# EAGLE design PiMonitorRF (EAGLE 7.5.0)
CNAME: PiCrusts; CREVISION: 1.0; DESIGNER: Prajwal Bhattaram
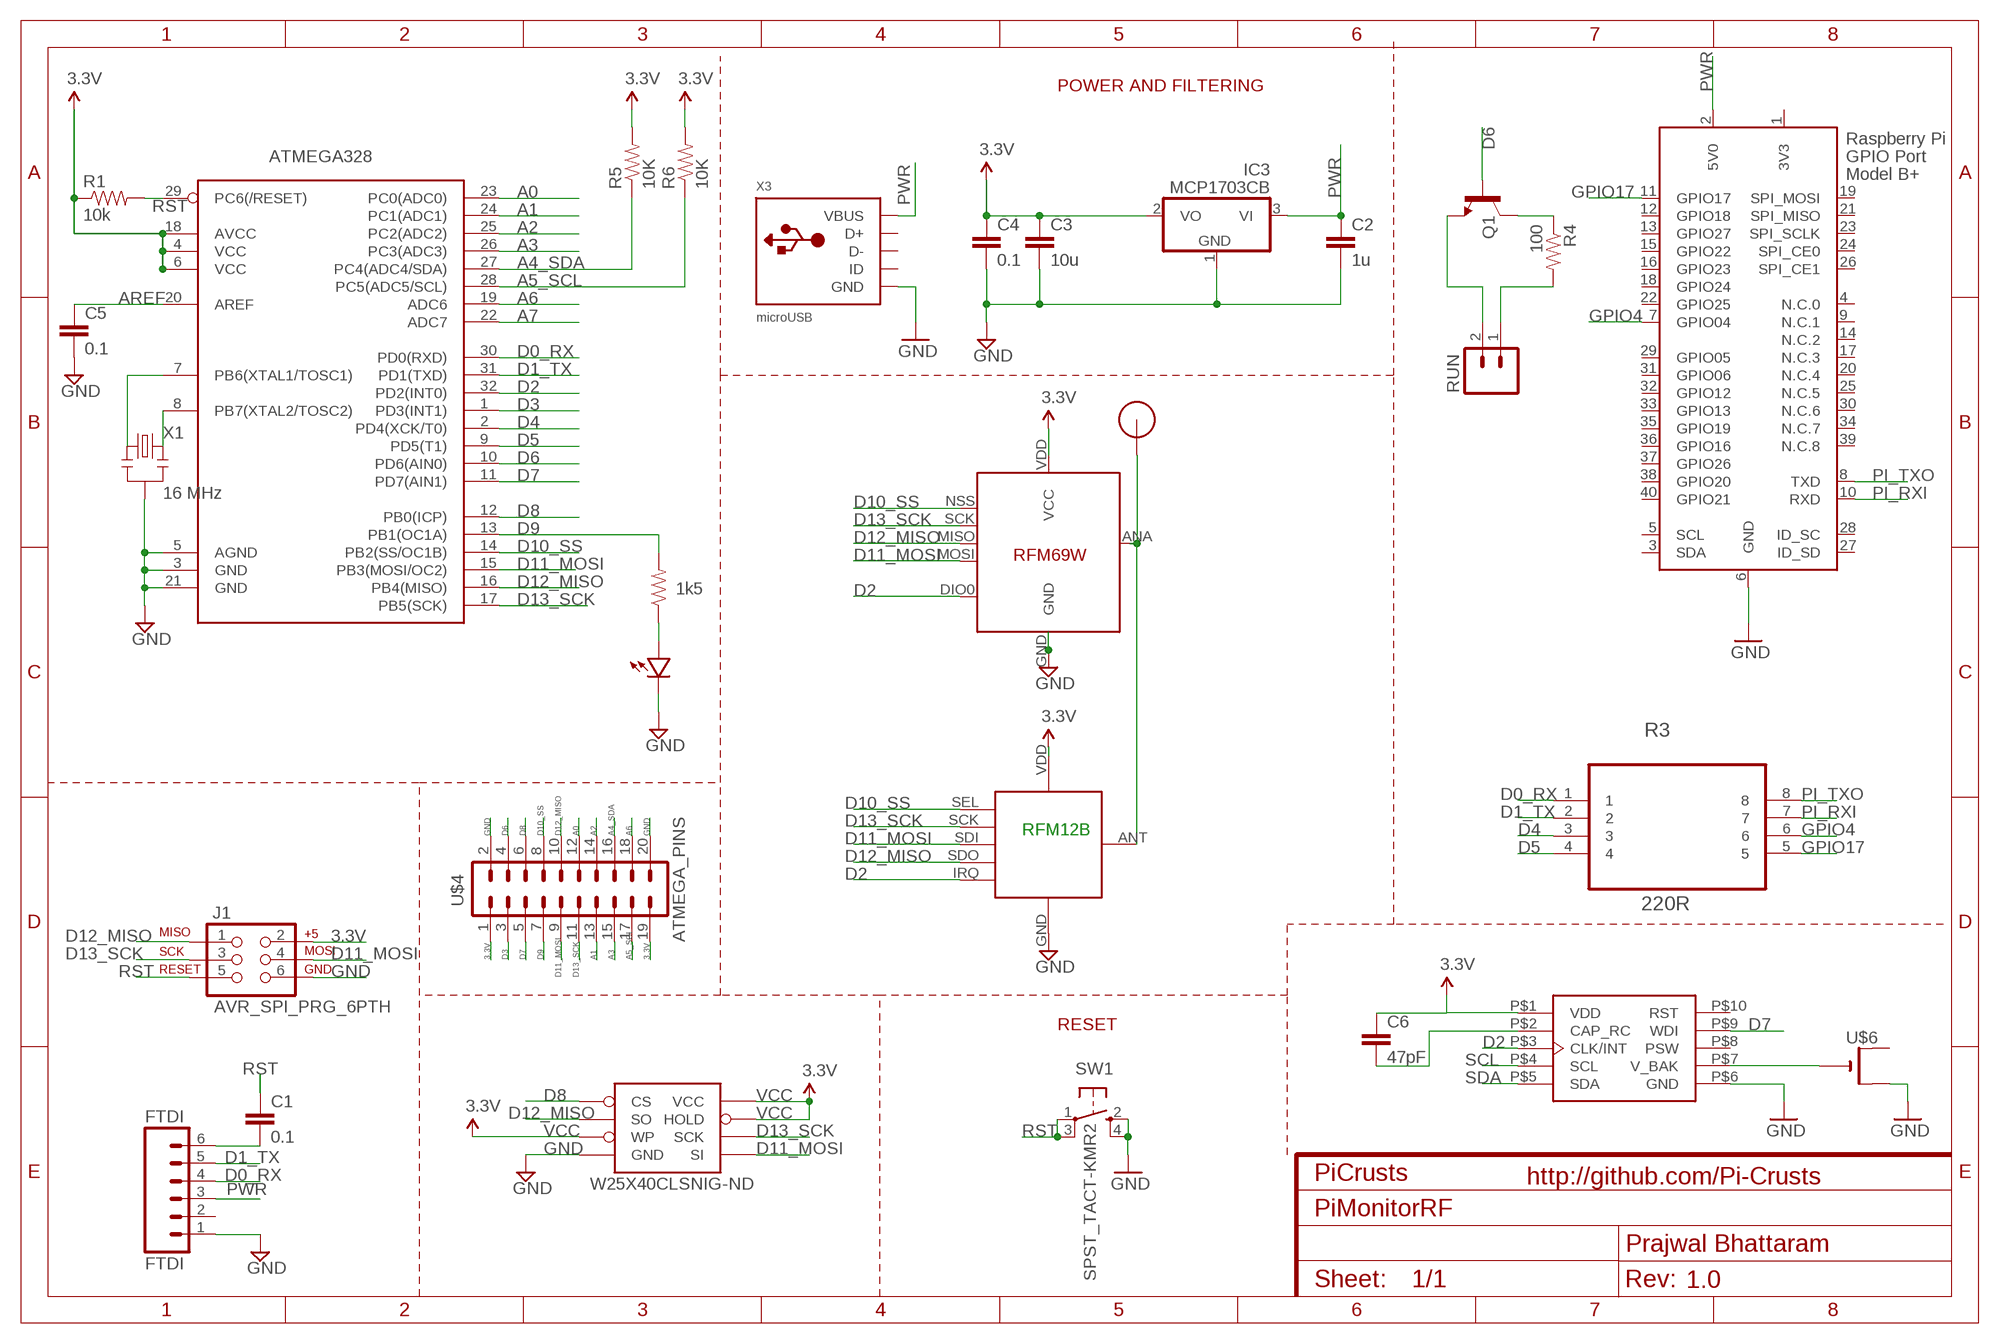
[diagram p0: schematic, sheet 1]

## Parts
ATMEGA328  ATMega-328  ATMEGA168/328TQFP32  [TQFP32-08]
C1  0.1  CAP0603-CAP  [0603-CAP]
C2  1u  CAP0603-CAP  [0603-CAP]
C3  10u  CAP0805-CAP  [0805-CAP]
C4  0.1  CAP0603-CAP  [0603-CAP]
C5  0.1  CAP0603-CAP  [0603-CAP]
C6  47pF  CAP0402-CAP  [0402-CAP]
FTDI  FTDI  M06SIP  [1X06]
IC3  MCP1703CB  [SOT23]
J1  AVR_SPI_PRG_6PTH  [2X3]
Q1  MMBT2222A  TRANSISTOR_NPNMMBT2222A  [SOT23-3]
R1  10k  RESISTOR0603-RES  [0603-RES]
R2  1k5  RESISTOR0603-RES  [0603-RES]
R3  220R  EXB38V221JV  [RESCAXE80P320X160X60-8N]
R4  100  RESISTOR0402-RES  [0402-RES]
R5  10K  RESISTOR0603  [0603-RES]
R6  10K  RESISTOR0603  [0603-RES]
RFM12B  RFM12B_MINPADS  [RFM12B-MINPADS]
RUN  M021X02_NO_SILK  [1X02_NO_SILK]
SW1  SPST_TACT-KMR2  [KMR2]
U$1  RFM12B_ANTENNA  [RFM12B-ANTENNA]
U$2  LED0603  [0603-LED]
U$4  ATMEGA_PINS  M10X2NOSILK  [2X10_NOSILK]
U$5  RFM69  [RFM69W-MINPADS]
U$6  CR1220SMT  [CR1220-SMD]
W25X40CLSNIG-ND  AT25F512BWIDE_5.3MM  [SO08WIDE]
X1  16 MHz  RESONATORSMD  [RESONATOR-SMD]
X2  MC-RTC-RV-1805-C3-I2C  [MC-RTC-C3]
X3  microUSB  USB_MICRO_20329_V2  [4UCONN_20329_V2]
X4  RASPI_BOARD_B+_HDC  [RASPI_BOARD_B+HAT_DF_CF]

## Nets
3.3V: J1.2 U$4.1 U$4.19
A0: ATMEGA328.23(PC0(ADC0)) U$4.12
A1: ATMEGA328.24(PC1(ADC1)) U$4.13
A2: ATMEGA328.25(PC2(ADC2)) U$4.14
A3: ATMEGA328.26(PC3(ADC3)) U$4.15
A4_SDA: ATMEGA328.27(PC4(ADC4/SDA)) R5.1 U$4.16
A5_SCL: ATMEGA328.28(PC5(ADC5/SCL)) R6.1 U$4.17
A6: ATMEGA328.19(ADC6) U$4.18
A7: ATMEGA328.22(ADC7)
AREF: ATMEGA328.20(AREF) C5.1
D0_RX: ATMEGA328.30(PD0(RXD)) FTDI.4 R3.1
D1_TX: ATMEGA328.31(PD1(TXD)) FTDI.5 R3.2
D2: ATMEGA328.32(PD2(INT0)) RFM12B.IRQ U$5.DIO0 X2.P$3(CLK/INT)
D3: ATMEGA328.1(PD3(INT1)) U$4.3
D4: ATMEGA328.2(PD4(XCK/T0)) R3.3
D5: ATMEGA328.9(PD5(T1)) R3.4
D6: ATMEGA328.10(PD6(AIN0)) Q1.1(B) U$4.4
D7: ATMEGA328.11(PD7(AIN1)) U$4.5 X2.P$9(WDI)
D8: ATMEGA328.12(PB0(ICP)) U$4.6 W25X40CLSNIG-ND.1(CS)
D9: ATMEGA328.13(PB1(OC1A)) R2.2 U$4.7
D10_SS: ATMEGA328.14(PB2(SS/OC1B)) RFM12B.SEL U$4.8 U$5.NSS(SEL)
D11_MOSI: ATMEGA328.15(PB3(MOSI/OC2)) J1.4 RFM12B.SDI(SDI/MOSI) U$4.9 U$5.MOSI W25X40CLSNIG-ND.5(SI)
D12_MISO: ATMEGA328.16(PB4(MISO)) J1.1 RFM12B.SDO(SDO/MISO) U$4.10 U$5.MISO W25X40CLSNIG-ND.2(SO)
D13_SCK: ATMEGA328.17(PB5(SCK)) J1.3 RFM12B.SCK U$4.11 U$5.SCK W25X40CLSNIG-ND.6(SCK)
GND [power]: ATMEGA328.3(GND) ATMEGA328.5(AGND) ATMEGA328.21(GND) C2.2 C3.2 C4.2 C5.2 FTDI.1 IC3.1(GND) J1.6 RFM12B.GND SW1.2(S) SW1.4(S1) U$2.MINUS U$4.2 U$4.20 U$5.GND U$6.+$2(+1) W25X40CLSNIG-ND.4(GND) X1.2 X2.P$6(GND) X3.BASE@1(GND) X3.BASE@2(GND) X3.GND X3.SPRT@1(GND) X3.SPRT@2(GND) X3.SPRT@3(GND) X3.SPRT@4(GND) X4.6(GND)
GPIO4: R3.6 X4.7(GPIO04)
GPIO17: R3.5 X4.11(GPIO17)
N$1: ATMEGA328.7(PB6(XTAL1/TOSC1)) X1.1
N$2: R2.1 U$2.PLUS
N$3: RFM12B.ANT U$1.P$1 U$5.ANA(ANT)
N$4: R4.2 RUN.1
N$5: Q1.2(E) RUN.2
N$6: U$6.- X2.P$7(V_BAK)
N$7: Q1.3(C) R4.1
N$8: C6.2 X2.P$2(CAP_RC)
N$20: C1.2 FTDI.6
N$21: ATMEGA328.8(PB7(XTAL2/TOSC2)) X1.3
PI_RXI: R3.7 X4.10(RXD)
PI_TXO: R3.8 X4.8(TXD)
PWR [power]: C2.1 FTDI.3 IC3.3(VI) X3.VBUS X4.2(5V0)
RST: ATMEGA328.29(PC6(/RESET)) C1.1 J1.5 R1.2 SW1.1(P) SW1.3(P1)
SCL: X2.P$4(SCL)
SDA: X2.P$5(SDA)
VCC: ATMEGA328.4(VCC) ATMEGA328.6(VCC) ATMEGA328.18(AVCC) C3.1 C4.1 C6.1 IC3.2(VO) R1.1 R5.2 R6.2 RFM12B.VDD U$5.VDD(VCC) W25X40CLSNIG-ND.3(WP) W25X40CLSNIG-ND.7(HOLD) W25X40CLSNIG-ND.8(VCC) X2.P$1(VDD) ; supply symbol labelled 3.3V
Unconnected: FTDI.2 U$6.+$1(+) X2.P$8(PSW) X2.P$10(RST) X3.D+ X3.D- X3.ID X4.3(SDA) X4.4(N.C.0) X4.5(SCL) X4.9(N.C.1) X4.12(GPIO18) X4.13(GPIO27) X4.14(N.C.2) X4.15(GPIO22) X4.16(GPIO23) X4.17(N.C.3) X4.18(GPIO24) X4.19(SPI_MOSI) X4.20(N.C.4) X4.21(SPI_MISO) X4.22(GPIO25) X4.23(SPI_SCLK) X4.24(SPI_CE0) X4.25(N.C.5) X4.26(SPI_CE1) X4.27(ID_SD) X4.28(ID_SC) X4.29(GPIO05) X4.30(N.C.6) X4.31(GPIO06) X4.32(GPIO12) X4.33(GPIO13) X4.34(N.C.7) X4.35(GPIO19) X4.36(GPIO16) X4.37(GPIO26) X4.38(GPIO20) X4.39(N.C.8) X4.40(GPIO21)

## Notes on the sheet
- POWER AND FILTERING
- RFM12B
- RESET
- http://github.com/Pi-Crusts

## Power pins joined to a net without a drawn wire
3V3: X4.1(3V3)

## Library data of the parts
ATMEGA328 = LowPowerLab:ATMEGA168/328: Atmel 32-pin 8-bit micro, 16k flash.
C1-C5 = LowPowerLab:CAP: Capacitor Standard 0603 ceramic capacitor, and 0.1" leaded capacitor.
C6 = SparkFun-Capacitors:CAP: Capacitor Standard 0603 ceramic capacitor, and 0.1" leaded capacitor.
FTDI = SparkFun-Connectors:M06: Header 6 Standard 6-pin 0.1" header. Use with straight break away headers (SKU : PRT-00116), right angle break away headers (PRT-00553), swiss pins (PRT-00743), machine pins (PRT-00117), and female headers (PRT-00115). Molex polarized connector foot print use with SKU : PRT-08094 with associated crimp pins and housings. NOTES ON THE VARIANTS LOCK and LOCK_LONGPADS... This footprint was designed to help hold the alignment of a through-hole component (i.e. 6-pin header) while soldering it into place. You may notice that each hole has been shifted either up or down by 0.005 of an inch from it's more standard position (which is a perfectly straight line). This slight alteration caused the pins (the squares in the middle) to touch the edges of the holes. Because they are alternating, it causes a "brace" to hold the component in place. 0.005 has proven to be the perfect amount of "off-center" position when using our standard breakaway headers. Although looks a little odd when you look at the bare footprint, once you have a header in there, the alteration is very hard to notice. Also, if you push a header all the way into place, it is covered up entirely on the bottom side. This idea of altering the position of holes to aid alignment will be further integrated into the Sparkfun Library for other footprints. It can help hold any component with 3 or more connection pins.
IC3 = linear:MCP1703: 250 mA, 16V, Low Quiescent Current LDO Regulator Source: http://ww1.microchip.com/downloads/en/DeviceDoc/22049b.pdf
J1 = SparkFun-Connectors:AVR_SPI_PRG_6: AVR ISP 6 Pin This is the reduced ISP connector for AVR programming. Common on Arduino. This footprint will take up less PCB space and can be used with a 10-pin to 6-pin adapter such as SKU: BOB-08508
Q1 = SparkFun-DiscreteSemi:TRANSISTOR_NPN: Generic NPN BJT MMBT2222A - TRANS-08049 (SOT-23, 1A 40V) MPSA42 - TRANS-09116 (SOT-23, 500mA 300V) MMBT5088LT1G - TRANS-11160 (SOT-23, 50 mA 30V); PROD_ID: TRANS-08049
R1 R2 = LowPowerLab:RESISTOR: Resistor Basic schematic elements and footprints for 0603, 1206, and PTH resistors.
R3 = Panasonic-EXB-ERJ:EXB38V: Chip Resistor Array; MPN: EXB38V221JV; OC_FARNELL: 2060094; OC_NEWARK: 65T9093; PACKAGE: 0603; POWERRATING: 0.063 W/element; SUPPLIER: PANASONIC; TOLERANCE: ±5 %
R4 = SparkFun-Passives:RESISTOR: Resistor Basic schematic elements and footprints for 0603, 1206, and PTH resistors.
R5 R6 = SparkFun-Resistors:RESISTOR: Resistor Basic schematic elements and footprints for 0603, 1206, and PTH resistors.
RFM12B = LowPowerLab:RFM12B_MINPADS
RUN = SparkFun-Connectors:M02: Standard 2-pin 0.1" header. Use with - straight break away headers ( PRT-00116) - right angle break away headers (PRT-00553) - swiss pins (PRT-00743) - machine pins (PRT-00117) - female headers (PRT-00115) Molex polarized connector foot print use with: PRT-08233 with associated crimp pins and housings. 2.54_SCREWTERM for use with PRT-10571. 3.5mm Screw Terminal footprints for PRT-08084 5mm Screw Terminal footprints for use with PRT-08433
SW1 = adafruit:SPST_TACT: SMT 6mm switch, EVQQ2 series http://www.ladyada.net/library/eagle
U$1 = LowPowerLab:RFM12B_ANTENNA
U$2 = LowPowerLab:LED
U$4 = SparkFun-Connectors:M10X2: This was SPECIALLY designed to be used with our Graphic LCD Backpack. Be sure you want to use this! It is not only staggered on each line of header holes, but IT IS ALSO offset of the center point of the top and bottom lines by 5 mil. This causes the headers to lock into place on the "standard" footprint on the LCD screen. The extra squares on the tdocu layer are there simply to reference other pins (if you were to actually populate a longer header than ten long - this is what we do with the backpacks).
U$5 = LowPowerLab:RFM69
U$6 = adafruit:CR1220: CR1216/CR1220/CR1225 12mm 3V lithium coin cell Great for battery packup. Both SMT and THM holders. Note the THM package has the ground pads on both sides of the PCB so that the masks are the same - this reduces the cost
W25X40CLSNIG-ND = LowPowerLab:AT25F512B: 4-Mbit SPI flash memory
X1 = SparkFun:RESONATOR: Resonator Small SMD resonator. This is the itty bitty 10/20MHz resonators with built in caps. CSTCE10M0G55 and CSTCE20M0V53. Footprint has been reviewed closely but hasn't been tested yet.
X2 = Microcrystal-RTC:MC-RTC-RV-1805-C3-I2C: MicroCrystal RV-1805-C3 Extreme Low Power RTC Module Extreme Low Current consumption XTAL-Mode 60nA RC-Mode 17nA RC Autocalibrated Mode 22nA Factory calibrated Time accuracy typ. ±2.0ppm @ 25°C Miniature SMT ceramic package with integrated Quartz Crystal for best Noise & EMI Immunity Automatic Battery Switchover, Trickle Charger, Power Management & Power Switch Function Programmable CLKOUT frequencies I2C Bus Interface (fast mode 400kHz) Time keeping mode down to 1.5 V Programmable Alarm, Timer and INT 512 Bytes of User RAM
X3 = microbuilder:USB: USB Connectors USBMINIB - Surface Mount Female Mini-B USB Connector 4UConnector: 06564
X4 = raspberrypi-components_v13:RASPI_BOARD_B+: Raspberry Pi GPIO connector with markings for the outer dimensions of the Raspberry Pi board model B+ with different sets of drill holes or mounting pads

## Net classes
1 power: width 0.381 mm, clearance 0.254 mm

## Board
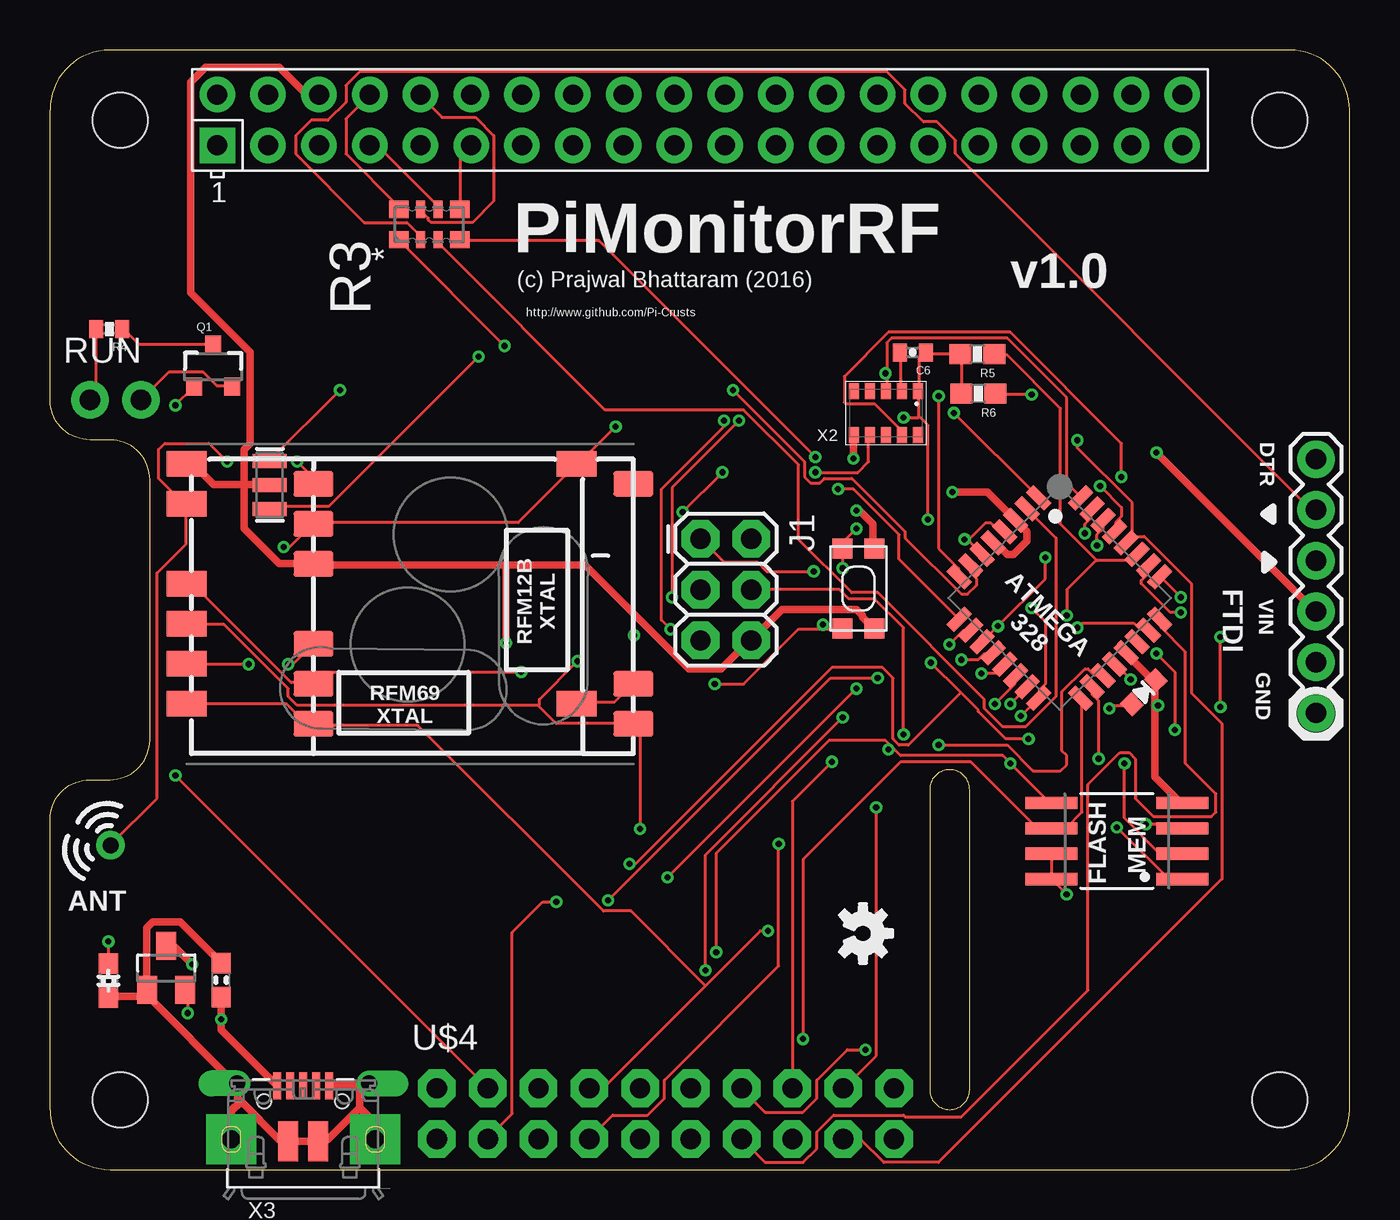
[diagram p1: board, top side]
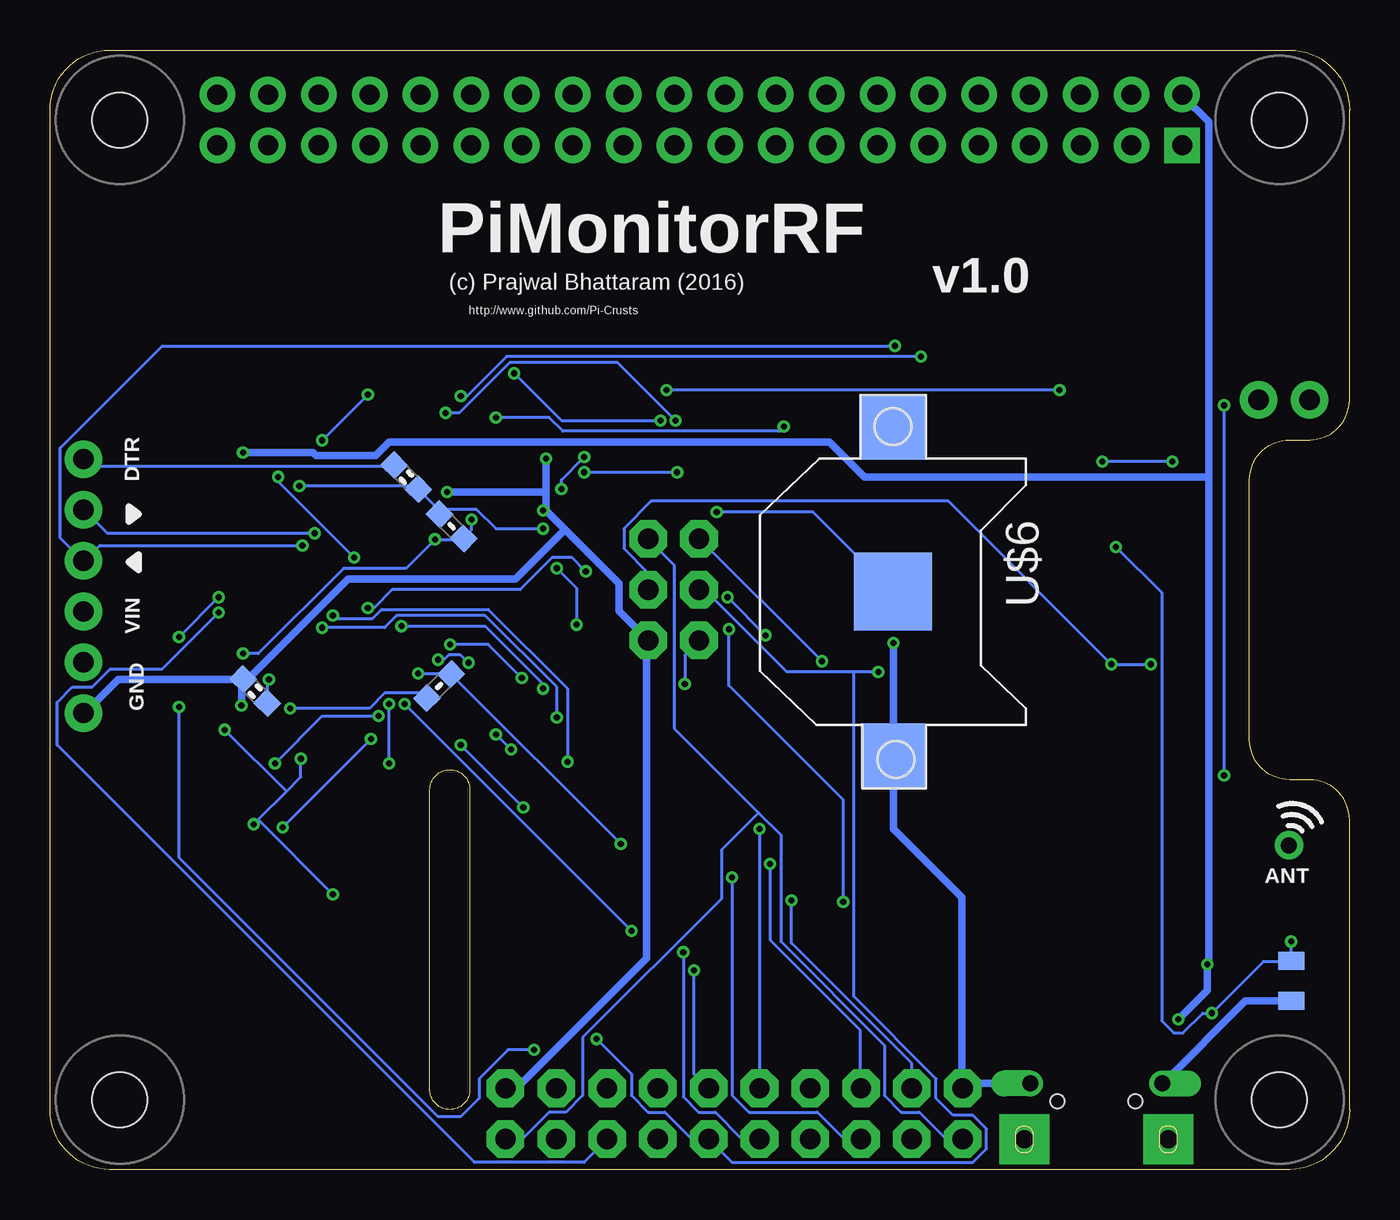
[diagram p2: board, bottom side, seen from below]

Size 65 x 56 mm. Coordinates in mm from the lower left corner, seen from the top.
Copper layers (1*16): Top 0.035mm / dielectric 1.5mm / Bottom 0.035mm
Design rules "ITEADstudio_DRC *": minimum track width 6mil, minimum drill 12mil, track to track 6mil, track to pad 6mil, pad to pad 6mil, via to via 6mil, smd to smd 0mil, copper to edge 10mil, drill to drill 10mil, minimum pad ring 10mil, minimum via ring 6mil, stop-mask expansion 2mil, vias tented up to drill 100mil, thermal gap 15mil
tRestrict: area 24.2,8.9 to 29,12.8; area 5.8,16.9 to 6.8,18.5; area 5.2,9.6 to 6.7,10.4
bRestrict: area 27.4,17.6 to 29.2,18.6; area 21,13.8 to 22.8,14.8; area 21.5,12.5 to 22,13.2; area 20.7,12.5 to 21.2,13.2; area 20.1,12.8 to 20.7,13.4; area 20.1,13.4 to 20.6,14; area 26.5,18.8 to 27,19.5; area 26.5,17.8 to 27,18.5; area 27.5,19.1 to 28,19.7; area 27.9,18.8 to 29,19.6

### Footprints (pad centres in the part's own frame; a part is rotated, then mirrored left to right if it is on the bottom)
TQFP32-08 = smd 1.27 x 0.533: 1 -4.293,2.8; 2 -4.293,2; 3 -4.293,1.2; 4 -4.293,0.4; 5 -4.293,-0.4; 6 -4.293,-1.2; 7 -4.293,-2; 8 -4.293,-2.8; 17 4.293,-2.8; 18 4.293,-2; 19 4.293,-1.2; 20 4.293,-0.4; 21 4.293,0.4; 22 4.293,1.2; 23 4.293,2; 24 4.293,2.8 | smd 0.533 x 1.27: 9 -2.8,-4.293; 10 -2,-4.293; 11 -1.2,-4.293; 12 -0.4,-4.293; 13 0.4,-4.293; 14 1.2,-4.293; 15 2,-4.293; 16 2.8,-4.293; 25 2.8,4.293; 26 2,4.293; 27 1.2,4.293; 28 0.4,4.293; 29 -0.4,4.293; 30 -1.2,4.293; 31 -2,4.293; 32 -2.8,4.293
0603-CAP = smd 1.016 x 0.965: 1 -0.85,0; 2 0.85,0
0805-CAP = smd 0.902 x 1.3: 1 -1,0; 2 1,0
0402-CAP = smd 0.7 x 0.9: 1 -0.65,0; 2 0.65,0
1X06 = drill 1.016 pad 1.88: 1 0,0; 2 2.54,0; 3 5.08,0; 4 7.62,0; 5 10.16,0; 6 12.7,0
SOT23 = smd 1 x 1.4: 1 -0.95,-1.1; 2 0.95,-1.1; 3 0,1.1
2X3 = drill 1.016 pad 1.88 octagon: 1 0,0; 2 0,2.54; 3 2.54,0; 4 2.54,2.54; 5 5.08,0; 6 5.08,2.54
SOT23-3 = smd 0.8 x 0.9: 1 -0.95,-1; 2 0.95,-1; 3 0,1.1
0603-RES = smd 1.016 x 0.965: 1 -0.85,0; 2 0.85,0
RESCAXE80P320X160X60-8N = smd 0.864 x 0.965: 1 -0.762,1.524; 4 -0.762,-1.524; 5 0.762,-1.524; 8 0.762,1.524 | smd 0.864 x 0.457: 2 -0.762,0.432; 3 -0.762,-0.432; 6 0.762,-0.432; 7 0.762,0.432
0402-RES = smd 0.7 x 0.9: 1 -0.65,0; 2 0.65,0
0603-RES' = smd 1.1 x 1: 1 -0.85,0; 2 0.85,0
RFM12B-MINPADS = smd 2 x 1.27: ANT 8,-6; GND 8,-2; IRQ -8,4; SCK 8,4; SDI 8,2; SDI1 -8.002,-6.001; SDO -8,6; SEL 8,6; VDD 8,-4
1X02_NO_SILK = drill 1.016 pad 1.88: 1 0,0; 2 2.54,0
KMR2 = smd 1 x 1: 1 2,0.8; 2 2,-0.8; 3 -2,0.8; 4 -2,-0.8
RFM12B-ANTENNA = drill 0.8 pad 1.422: P$1 0,0
0603-LED = smd 0.8 x 0.9: MINUS -0.85,0; PLUS 0.85,0
2X10_NOSILK = drill 1.016 pad 1.88 octagon: 1 -11.43,-1.27; 2 -11.43,1.27; 3 -8.89,-1.27; 4 -8.89,1.27; 5 -6.35,-1.27; 6 -6.35,1.27; 7 -3.81,-1.27; 8 -3.81,1.27; 9 -1.27,-1.27; 10 -1.27,1.27; 11 1.27,-1.27; 12 1.27,1.27; 13 3.81,-1.27; 14 3.81,1.27; 15 6.35,-1.27; 16 6.35,1.27; 17 8.89,-1.27; 18 8.89,1.27; 19 11.43,-1.27; 20 11.43,1.27
RFM69W-MINPADS = smd 2 x 1.27: ANA 8,-5; DIO0 -11.5,5; GND 8,-7; MISO 8,1; MOSI 8,3; NSS 8,5; SCK 8,-1; VDD -11.5,-7
CR1220-SMD = smd 3.2 x 3.2: +$1 -8.2,0; +$2 8.2,0 | smd 3.9 x 3.9: - 0,0
SO08WIDE = smd 0.61 x 2.6: 1 -1.905,-3.269; 2 -0.635,-3.269; 3 0.635,-3.269; 4 1.905,-3.269; 5 1.905,3.286; 6 0.635,3.286; 7 -0.635,3.286; 8 -1.905,3.286
RESONATOR-SMD = smd 0.7 x 1.7: 1 -1.2,0; 2 0,0; 3 1.2,0
MC-RTC-C3 = smd 0.5 x 0.8: P$1 -1.6,-1.1; P$2 -0.8,-1.1; P$3 0,-1.1; P$4 0.8,-1.1; P$5 1.6,-1.1; P$6 1.6,1.1; P$7 0.8,1.1; P$8 0,1.1; P$9 -0.8,1.1; P$10 -1.6,1.1
4UCONN_20329_V2 = smd 1 x 2: BASE@1 -0.75,-2; BASE@2 0.75,-2 | smd 0.4 x 1.35: D+ 0,0.775; D- -0.65,0.775; GND 1.3,0.775; ID 0.65,0.775; VBUS -1.3,0.775 | drill 0.8 pad 1.2 offset: SPRT@1 -3.3,0.9; SPRT@2 3.3,0.9 | drill 0.9 pad 2.5 square: SPRT@3 -3.6,-1.9; SPRT@4 3.6,-1.9 | hole 0.7: -1.95,0; 1.95,0
RASPI_BOARD_B+HAT_DF_CF = drill 1 pad 1.778 square: 1 8.37,51.23 | drill 1 pad 1.778: 2 8.37,53.77; 3 10.91,51.23; 4 10.91,53.77; 5 13.45,51.23; 6 13.45,53.77; 7 15.99,51.23; 8 15.99,53.77; 9 18.53,51.23; 10 18.53,53.77; 11 21.07,51.23; 12 21.07,53.77; 13 23.61,51.23; 14 23.61,53.77; 15 26.15,51.23; 16 26.15,53.77; 17 28.69,51.23; 18 28.69,53.77; 19 31.23,51.23; 20 31.23,53.77; 21 33.77,51.23; 22 33.77,53.77; 23 36.31,51.23; 24 36.31,53.77; 25 38.85,51.23; 26 38.85,53.77; 27 41.39,51.23; 28 41.39,53.77; 29 43.93,51.23; 30 43.93,53.77; 31 46.47,51.23; 32 46.47,53.77; 33 49.01,51.23; 34 49.01,53.77; 35 51.55,51.23; 36 51.55,53.77; 37 54.09,51.23; 38 54.09,53.77; 39 56.63,51.23; 40 56.63,53.77 | hole 2.75: 3.5,3.5; 3.5,52.5; 61.5,3.5; 61.5,52.5

### Placement (x,y rotation side)
ATMEGA328  50.5,28.59 315 top
C1  47.18,34.63 135 bottom
C2  8.56,9.47 90 top
C3  2.92,9.45 270 bottom
C4  2.92,9.45 270 top
C5  54.74,23.93 135 bottom
C6  43.15,40.87 180 top
FTDI  63.32,22.83 90 top
IC3  5.82,10.08 0 top
J1  32.54,31.55 270 top
Q1  8.15,40.16 0 top
R1  44.91,32.17 135 bottom
R2  45.54,24.18 45 bottom
R3  18.97,47.27 90 top
R4  2.97,42.04 180 top
R5  10K  [0603-RES']  46.38,40.79 180 top
R6  10K  [0603-RES']  46.43,38.81 180 top
RFM12B  21.18,28.3 180 top
RUN  2.01,38.51 0 top
SW1  40.44,29.06 90 top
U$1  3.03,16.22 340 bottom
U$2  54.71,23.88 225 top
U$3  [OSHW-LOGO-S]  40.67,11.81 270 top
U$4  30.78,2.79 0 top
U$5  14.83,28.3 180 top
U$6  22.83,28.91 270 bottom
W25X40CLSNIG-ND  53.37,16.43 90 top
X1  11,34.24 270 top
X2  41.81,37.85 180 top
X3  12.67,3.4 0 top
X4  0,0 0 top

### Tracks (layer width: path | path; a pad name or v marks a point on that pad's centre or on a via)
3.3V
  Bottom 0.152: 29.55,17.84 33.78,22.07 33.78,30.23 35.08,31.52 J1.2 | 29.55,17.84 28.45,16.74 28.45,11.4 23.27,6.22 23.27,3.71 22.43,2.87 21.51,2.87 20.22,1.57 19.38,1.57 U$4.1 | 29.55,17.84 31.42,15.98 31.42,13.54 38.35,6.6 38.35,3.71 39.19,2.87 40.03,2.87 41.33,1.57 42.16,1.57 U$4.19
A0  (via drill 0.3)
  Top 0.152: v51.38,27.1 51.61,27.33 54.2,27.33 54.51,27.03 54.89,27.03 ATMEGA328.23 | v39.65,22.61 32.79,15.75 v32.79,9.96
  Bottom 0.152: v51.38,27.1 48.26,27.1 47.65,27.71 43.23,27.71 39.65,24.13 v39.65,22.61 | v32.79,9.96 32.79,4.78 32.11,4.09 U$4.12
A1
  Top 0.152: U$4.13 35.76,0.36 37.67,0.36 38.35,1.04 38.35,1.88 39.19,2.72 42.7,2.72 42.77,2.64 45.59,2.64 51.92,8.97 51.92,19.25 53.52,20.85 53.98,20.85 54.28,20.55 54.28,18.57 55.19,17.65 58.09,17.65 58.32,17.88 58.32,18.8 56.79,20.32 56.79,25.88 55.58,27.1 55.58,27.48 ATMEGA328.24
A2  (via drill 0.3)
  Top 0.152: v56.57,28.63 55.58,29.62 ATMEGA328.25 | v58.55,23.14 v58.55,26.64 | v40.79,5.99 39.88,5.99 38.35,4.47 38.35,3.56 37.67,2.87 35.76,2.87 34.62,4.01 U$4.14
  Bottom 0.152: v58.55,26.64 v56.57,28.63 | v58.55,23.14 58.55,15.6 45.59,2.64 44.45,2.64 43.54,3.56 43.54,4.55 42.09,5.99 v40.79,5.99
A3  (via drill 0.3)
  Top 0.152: v56.57,27.86 56.03,27.86 54.58,29.31 54.58,29.46 54.89,29.77 54.89,30.15 ATMEGA328.26
  Bottom 0.152: v56.57,27.86 59.39,25.04 61.98,25.04 62.89,24.13 63.88,24.13 64.64,23.37 64.64,21.23 43.76,0.36 38.28,0.36 37.14,1.5 U$4.15
A4_SDA  (via drill 0.3)
  Top 0.152: 52.34,30.49 52.38,30.45 54.05,30.45 54.36,30.76 ATMEGA328.27 | 52.34,30.49 50.55,32.28 50.55,38.07 47.88,40.74 47.27,40.74 R5.1 | U$4.16 37.14,18.41 v39.12,20.4 | v50.85,27.71 50.85,29.01 52.34,30.49
  Bottom 0.152: v39.12,20.4 39.12,24.05 43.08,28.02 48.41,28.02 48.87,27.56 50.7,27.56 v50.85,27.71
A5_SCL  (via drill 0.3)
  Top 0.152: v49.1,38.76 47.35,38.76 R6.1 | v51.38,36.47 51.38,36.09 54.13,33.35 54.13,31.67 | 54.13,31.67 53.82,31.37 ATMEGA328.28 54.13,31.67 | 54.13,31.67 54.74,31.67 57.1,29.31 57.1,23.83 58.62,22.3 58.62,14.53 44.45,0.36 41.71,0.36 40.56,1.5 39.73,1.5 U$4.17
  Bottom 0.152: v51.38,36.47 v49.1,38.76
A6  (via drill 0.3)
  Top 0.152: v44.45,21.23 47.88,21.23 49.17,19.94 50.55,19.94 50.85,20.24 50.85,20.7 50.62,20.93 50.62,23.9 51.77,25.04 51.92,25.04 52.22,24.74 52.68,24.74 ATMEGA328.19 | v41.33,18.11 41.33,5.69 39.73,4.09 U$4.18
  Bottom 0.152: v41.33,18.11 v44.45,21.23
AREF  (via drill 0.3)
  Top 0.152: v54.05,24.51 53.29,25.27 ATMEGA328.20
  Bottom 0.152: v54.05,24.51 54.13,24.43 54.13,23.37 C5.1
D0_RX  (via drill 0.3)
  Top 0.152: v22.73,41.2 17.48,46.46 R3.1 | v52.38,31.22 52.38,31.75 52.68,32.05 52.68,32.44 ATMEGA328.30
  Bottom 0.152: v22.73,41.2 59.39,41.2 64.49,36.09 64.49,31.6 63.35,30.45 FTDI.4 63.27,30.45 62.51,31.22 v52.38,31.22
D1_TX  (via drill 0.3)
  Top 0.152: R3.2 18.54,46.69 17.86,47.37 15.72,47.37 12.29,50.8 12.29,51.71 13.06,52.48 13.89,52.48 14.81,53.39 14.81,54.23 15.49,54.91 41.86,54.91 42.77,54 42.77,53.31 43.69,52.4 44.37,52.4 45.29,51.49 45.29,50.8 63.04,33.05 63.27,33.05 FTDI.5 | v51.77,31.83 51.77,32.28 52.07,32.59 52.07,32.97 ATMEGA328.31
  Bottom 0.152: v51.77,31.83 62.13,31.83 63.27,32.97 FTDI.5
D2  (via drill 0.3)
  Top 0.152: U$5.DIO0 26.39,23.37 28.22,23.37 29.13,24.28 RFM12B.IRQ 29.21,24.36 v29.21,26.72 | 41.86,39.83 41.86,41.35 42.09,41.58 47.88,41.58 50.85,38.61 50.85,34.34 51.54,33.65 ATMEGA328.32 | 41.86,39.83 41.86,38.99 X2.P$3 | v31.12,28.63 31.12,34.11 v34.47,37.46 | 41.86,39.83 v41.78,39.83
  Bottom 0.152: v31.12,28.63 v29.21,26.72 | v34.47,37.46 39.42,37.46 v41.78,39.83
D3  (via drill 0.3)
  Top 0.152: v45.21,37.85 49.4,33.65 ATMEGA328.1 | v33.71,37.46 33.71,37.16 30.58,34.04 30.58,27.48 v31.04,27.03 | v25.32,13.39 24.64,13.39 23.11,11.86 23.11,2.79 21.9,1.57 U$4.3
  Bottom 0.152: v45.21,37.85 44.53,37.85 42.01,40.36 36.6,40.36 v33.71,37.46 | v31.04,27.03 31.04,24.21 25.32,18.49 v25.32,13.39
D4
  Top 0.152: R3.3 19.46,46.46 19.46,46.3 27.76,38 34.7,38 37.44,35.26 37.44,31.52 40.11,28.85 41.4,28.85 46.74,23.52 46.74,23.06 47.65,22.15 48.79,22.15 50.32,23.67 50.32,31.6 48.95,32.97 ATMEGA328.2
D5  (via drill 0.3)
  Top 0.152: v38.28,35.64 27.46,46.46 20.52,46.46 R3.4 | v39.42,34.04 40.18,34.04 42.47,31.75 42.47,30.53 45.44,27.56 ATMEGA328.9
  Bottom 0.152: v38.28,35.64 39.42,34.49 v39.42,34.04
D6  (via drill 0.3)
  Top 0.152: v6.27,38.23 7.19,39.14 Q1.1 | v6.27,19.71 21.9,4.09 U$4.4 | v44.98,26.26 45.67,26.95 45.97,26.95 ATMEGA328.10 | v41.4,24.59 39.04,24.59 v27.91,13.46
  Bottom 0.152: v6.27,19.71 v6.27,38.23 | v44.98,26.26 43.08,26.26 v41.4,24.59 | v27.91,13.46 27.91,11.33 21.9,5.31 U$4.4
D7  (via drill 0.3)
  Top 0.152: v53.59,34.65 53.59,36.32 48.03,41.88 41.94,41.88 39.73,39.67 39.73,38.38 39.8,38.3 41.25,38.3 42.55,37.01 42.55,36.78 X2.P$9 | v49.78,30.61 49.78,29.54 v47.42,27.18 46.66,26.42 ATMEGA328.11 | v40.34,24.05 v30.89,14.6
  Bottom 0.152: v53.59,34.65 53.59,34.42 v49.78,30.61 | v30.89,14.6 30.89,3.71 30.05,2.87 26.62,2.87 25.32,1.57 24.49,1.57 U$4.5 | v40.34,24.05 40.34,24.28 43.23,27.18 v47.42,27.18
D8  (via drill 0.3)
  Top 0.152: v45.59,25.5 46.43,25.5 46.74,25.81 47.12,25.81 ATMEGA328.12 | 45.56,23.86 46.43,22.99 46.43,22.91 47.8,21.54 v48.95,21.54 | 45.56,23.86 v44.07,25.35 | v53.37,17.12 55.96,14.53 W25X40CLSNIG-ND.1 | v28.98,15.29 29.29,15.29 39.12,25.12 41.63,25.12 42.16,24.59 42.16,21.54 42.47,21.23 42.93,21.23 45.56,23.86
  Bottom 0.152: v45.59,25.5 45.29,25.5 45.06,25.73 44.45,25.73 v44.07,25.35 | v53.37,17.12 v48.95,21.54 | v28.98,15.29 28.98,11.48 24.49,6.98 24.49,4.09 U$4.6
D9  (via drill 0.3)
  Top 0.152: v46.58,24.82 47.35,24.82 47.73,25.2 ATMEGA328.13 | v36.45,16.28 36.45,10.19 30.73,4.47 30.73,3.56 29.9,2.72 28.14,2.72 27,1.57 U$4.7
  Bottom 0.152: v46.58,24.82 44.98,24.82 R2.2 44.91,24.74 v36.45,16.28
D10_SS  (via drill 0.3)
  Top 0.152: U$5.NSS 6.88,23.29 11.84,23.29 12.83,22.3 13.13,22.3 RFM12B.SEL 13.21,22.22 18.39,22.22 27.69,12.93 29.06,12.93 32.79,9.19 | v47.27,23.29 48.26,24.28 48.26,24.66 ATMEGA328.14 | v35.92,11.94 35.53,11.94 32.79,9.19 | 32.79,9.19 27.69,4.09 27,4.09 U$4.8
  Bottom 0.152: v35.92,11.94 v47.27,23.29
D11_MOSI  (via drill 0.3)
  Top 0.152: v9.93,25.27 6.88,25.27 U$5.MOSI | v11.91,25.27 12.14,25.27 13.13,26.26 RFM12B.SDI | v48.03,23.29 48.87,24.13 ATMEGA328.15 | W25X40CLSNIG-ND.5 50.01,18.34 v48.03,20.32 47.65,20.7 42.55,20.7 42.09,21.16 | v33.33,10.87 33.33,15.82 38.96,21.46 41.78,21.46 42.09,21.16 | J1.4 39.5,29.01 39.95,28.55 41.25,28.55 42.7,27.1 v42.7,21.77 | 42.09,21.16 v41.94,21.01
  Bottom 0.152: v9.93,25.27 v11.91,25.27 20.07,33.43 34.93,33.43 36.3,32.05 36.3,31.06 35.08,29.84 J1.4 | v48.03,20.32 v48.03,23.29 | v33.33,10.87 33.33,3.63 32.56,2.87 31.72,2.87 30.43,1.57 29.52,1.57 U$4.9 | v41.94,21.01 v42.7,21.77
D12_MISO  (via drill 0.3)
  Top 0.152: v48.57,22.68 49.4,23.52 ATMEGA328.16 49.48,23.6 49.48,23.98 49.78,24.28 49.78,27.41 v49.1,28.09 | v53.75,20.32 53.75,17.58 55.5,15.82 56.57,15.82 W25X40CLSNIG-ND.2 | 24.45,23.18 25.32,22.3 29.13,22.3 RFM12B.SDO 29.21,22.22 29.52,21.92 v29.52,17.04 | 24.45,23.18 24.41,23.22 12.37,23.22 11.91,23.67 11.91,24.05 8.71,27.25 6.88,27.25 U$5.MISO | v26.39,25.43 24.49,23.52 24.49,23.22 24.45,23.18 | v38.2,29.92 35.84,29.92 35.38,30.38 33.71,30.38 J1.1
  Bottom 0.152: v48.57,22.68 51.38,22.68 v53.75,20.32 | v29.52,17.04 U$4.10 | v26.39,25.43 32.49,31.52 J1.1 | v49.1,28.09 48.79,28.09 47.88,29.01 41.48,29.01 39.88,30.61 38.89,30.61 v38.2,29.92
D13_SCK  (via drill 0.3)
  Top 0.152: U$5.SCK 6.88,29.24 7.19,29.24 12.07,24.36 13.13,24.36 RFM12B.SCK 13.21,24.36 13.74,24.89 v23.57,24.89 | ATMEGA328.17 51.61,23.52 51.61,17.88 50.85,17.12 50.09,17.12 W25X40CLSNIG-ND.6 50.01,17.12 49.33,17.12 46.05,20.4 42.55,20.4 37.67,15.52 v37.67,6.53
  Bottom 0.152: J1.3 32.26,29.01 28.14,24.89 24.79,24.89 | v23.57,24.89 24.79,24.89 | v37.67,6.53 35.92,4.78 35.92,3.71 35.08,2.87 34.24,2.87 32.94,1.57 32.11,1.57 U$4.11 30.89,0.36 18.85,0.36 18.16,1.04 18.16,2.03 18.85,2.72 19.84,2.72 20.68,3.56 20.68,4.55 24.79,8.66 24.79,24.89
GND  (via drill 0.3)
  Top 0.381: C4.2 2.92,8.66 4.52,8.66 4.83,8.97 IC3.1 | C2.2 8.56,10.34 6.5,12.4 5.13,12.4 4.83,12.09 4.83,9.12 IC3.1 | IC3.1 4.83,8.74 9.32,4.24 X3.SPRT@1 9.4,4.09 9.4,3.56 9.55,3.4 11.46,1.5 11.76,1.5 X3.BASE@1 11.99,1.42 13.36,1.42 X3.BASE@2 13.59,1.5 13.89,1.5 15.49,3.1 15.49,4.09 X3.SPRT@2 15.95,4.24 14.05,4.24 X3.GND | 9.7,34.26 8.18,34.26 7.19,35.26 6.88,35.26 U$5.GND 6.88,35.33 | 9.7,34.26 11,34.26 X1.2 | 9.7,34.26 9.7,32.05 11.46,30.3 13.13,30.3 RFM12B.GND 13.36,30.23 22.81,30.23 | 9.7,34.26 9.7,36.02 10.01,36.32 10.01,40.89 7.04,43.87 7.04,54.38 7.8,55.14 11.46,55.14 12.83,53.77 13.44,53.77 X4.6 | ATMEGA328.21 53.82,25.81 55.12,24.51 55.27,24.51 U$2.MINUS 55.27,24.28 55.27,23.22 | 55.27,23.22 55.27,19.63 56.57,18.34 W25X40CLSNIG-ND.4 | v55.42,23.22 55.27,23.22 | ATMEGA328.5 47.19,31.29 47.35,31.29 47.88,30.76 48.18,30.76 48.87,31.45 48.87,31.9 48.34,32.44 ATMEGA328.3 48.18,32.59 46.89,33.88 v45.14,33.88 | v40.18,35.56 40.18,36.7 X2.P$6 | SW1.4 41.17,27.1 40.64,27.64 40.64,27.71 40.34,28.02 36.6,28.02 35.08,26.49 J1.6 34.93,26.42 33.55,25.04 31.95,25.04 26.77,30.23 22.81,30.23 | v40.34,32.97 40.49,32.97 41.17,32.28 41.17,31.06 SW1.2 | 22.81,30.23 v22.81,26.34
  Top 0.406: X3.SPRT@3 9.07,2.93 9.55,3.4 | X3.SPRT@4 16.27,2.32 15.49,3.1
  Bottom 0.381: C3.2 2.92,8.43 5.21,8.43 9.32,4.32 X3.SPRT@1 | X3.SPRT@2 16.03,4.32 19.23,4.32 U$4.2 19.38,4.09 19.38,13.61 22.81,17.04 22.81,20.7 U$6.+$2 22.81,20.85 v22.81,26.34 | C5.2 55.35,24.51 61.6,24.51 63.27,22.83 FTDI.1 | v55.42,23.22 55.42,24.36 C5.2 | 40.18,32.97 40.18,33.88 | 40.18,33.88 v40.18,35.56 | 39.23,32.02 36.53,29.31 36.53,27.94 35.08,26.49 J1.6 35.15,26.34 35.15,10.57 41.63,4.09 42.16,4.09 U$4.20 | 39.23,32.02 40.18,32.97 | v40.34,32.97 40.18,32.97 | 40.18,33.88 v45.14,33.88 | 39.23,32.02 41.71,29.54 50.09,29.54 54.97,24.66 55.19,24.66 C5.2
GPIO4
  Top 0.152: R3.6 19.38,48.06 19.38,48.21 16.41,51.18 16.03,51.18 X4.7
GPIO17
  Top 0.152: R3.5 20.52,48.06 20.52,50.65 21.06,51.18 X4.11
N$1  (via drill 0.3)
  Top 0.152: v34.16,38.99 37.74,35.41 37.74,34.65 38.05,34.34 38.51,34.34 38.74,34.57 40.11,34.57 42.77,31.9 42.77,31.6 45.59,28.78 45.9,28.78 46.36,29.24 46.36,29.54 46.05,29.84 46.05,30.15 ATMEGA328.7 | v14.5,38.99 11,35.48 X1.1
  Bottom 0.152: v14.5,38.99 v34.16,38.99
N$2  (via drill 0.3)
  Top 0.152: v52.98,23.06 53.14,23.22 54.05,23.22 U$2.PLUS
  Bottom 0.152: v52.98,23.06 49.02,23.06 48.26,23.83 46.43,23.83 46.2,23.6 R2.1
N$3  (via drill 0.3)
  Top 0.152: U$1.P$1 3.07,16.28 5.36,18.57 5.36,29.84 6.81,31.29 6.81,33.27 U$5.ANA 6.73,33.27 5.44,34.57 5.44,36.02 5.74,36.32 7.95,36.32 v8.86,35.41 | v12.37,35.41 13.13,34.65 13.13,34.34 RFM12B.ANT
  Bottom 0.152: v8.86,35.41 v12.37,35.41
N$4
  Top 0.152: R4.2 2.31,38.84 2.01,38.53 RUN.1
N$5
  Top 0.152: Q1.2 9.09,39.22 8.33,39.22 7.65,39.9 5.97,39.9 4.6,38.53 RUN.2
N$6  (via drill 0.3)
  Top 0.152: v38.28,34.87 40.41,34.87 40.95,35.41 40.95,36.7 X2.P$7 | v31.65,32.89 v33.63,34.87
  Bottom 0.152: v33.63,34.87 v38.28,34.87 | v31.65,32.89 26.85,32.89 22.89,28.93 U$6.-
N$7
  Top 0.152: Q1.3 8.1,41.27 4.45,41.27 3.68,42.04 R4.1
N$8
  Top 0.152: X2.P$2 42.55,38.99 42.55,40.82 C6.2
N$20
  Bottom 0.152: FTDI.6 62.97,35.18 47.8,35.18 C1.2
N$21  (via drill 0.3)
  Top 0.152: v44.45,38.68 44.45,31.06 45.44,30.07 45.44,29.69 ATMEGA328.8 | v21.44,40.67 13.97,33.2 11.15,33.2 X1.3
  Bottom 0.152: v44.45,38.68 44.15,38.68 42.16,40.67 v21.44,40.67
PI_RXI
  Top 0.152: R3.7 18.54,47.98 18.92,47.6 18.92,47.52 19.08,47.37 21.13,47.37 22.2,48.44 22.2,51.71 21.29,52.63 19.61,52.63 18.54,53.7 X4.10
PI_TXO
  Top 0.152: R3.8 17.4,48.06 17.4,48.21 14.81,50.8 14.81,52.55 15.95,53.7 X4.8
PWR  (via drill 0.3)
  Top 0.381: C2.1 v8.56,7.52 8.56,6.98 11.3,4.24 X3.VBUS | v7.11,10.26 6.2,11.18 IC3.3 | v55.35,35.86 63.27,27.94 FTDI.3
  Bottom 0.381: v8.56,7.52 7.11,8.97 v7.11,10.26 7.04,10.41 7.04,34.65 | 7.04,34.65 7.04,52.4 8.33,53.7 X4.2 | v55.35,35.86 51.84,35.86 51.69,35.71 48.72,35.71 48.03,36.4 26.01,36.4 24.26,34.65 7.04,34.65
RST  (via drill 0.3)
  Top 0.152: 38.66,27.03 37.44,27.03 34.7,24.28 v33.25,24.28 | 38.66,27.03 39.57,27.03 SW1.3 | v40.34,32.05 39.65,31.37 SW1.1 39.65,30.99 v39.65,30.07 | v52.53,34.19 53.59,33.12 53.59,32.66 53.29,32.36 53.29,31.98 ATMEGA328.29 | v38.66,27.25 38.66,27.03
  Bottom 0.152: v33.25,24.28 33.25,25.73 32.56,26.42 J1.5 | v40.34,32.05 42.7,32.05 43.69,33.05 45.21,33.05 45.44,32.82 R1.2 45.44,32.89 46.51,33.96 C1.1 46.74,34.19 v52.53,34.19 | v38.66,27.25 38.66,29.08 v39.65,30.07
VCC  (via drill 0.3)
  Top 0.152: W25X40CLSNIG-ND.8 50.09,15.75 W25X40CLSNIG-ND.7 | v52.45,20.55 52.45,23.44 52.15,23.75 52.15,24.13 ATMEGA328.18 | v54.81,17.27 56.41,17.27 56.57,17.12 W25X40CLSNIG-ND.3 | v50.85,13.77 W25X40CLSNIG-ND.8 | W25X40CLSNIG-ND.8 | R6.2 45.59,38.84 45.59,40.74 R5.2 45.52,40.82 43.84,40.82 C6.1 43.76,40.82 43.46,40.51 43.46,38.99 X2.P$1 43.46,38.91 43.46,37.69 43.5,37.66 | ATMEGA328.6 46.58,30.84 45.9,31.52 v45.75,31.52 45.97,31.52 46.81,32.36 47.04,32.36 47.42,31.98 47.73,31.98 ATMEGA328.4 | 43.5,37.66 43.92,37.24 v43.92,32.51 | v2.92,11.4 C4.1 | v6.88,7.82 6.88,8.89 6.81,8.97 IC3.2 | U$5.VDD 26.31,35.26 23.42,32.36 13.21,32.36 RFM12B.VDD 13.13,32.28 11.99,31.14 v11.68,31.14 | 26.39,35.33 U$5.VDD | v42.7,37.62 43.46,37.62 43.5,37.66 | v28.3,37.16 26.47,35.33 U$5.VDD | v56.26,22 56.26,24.89 v55.35,25.81
  Bottom 0.152: v52.45,20.55 52.45,19.63 53.18,18.91 | v54.81,17.27 54.58,17.5 | 54.58,17.5 53.18,18.91 | 54.58,17.5 v50.85,13.77 | v43.92,32.51 43.92,31.98 44.3,31.6 R1.1 44.37,31.52 v45.75,31.52 47.19,30.07 50.32,30.07 54.58,25.81 v55.35,25.81 | v2.92,11.4 C3.1 2.92,10.41 4.29,10.41 v6.88,7.82 7.34,7.82 8.33,6.83 8.79,6.83 9.4,7.44 9.4,28.85 v11.68,31.14 | v42.7,37.62 40.03,37.62 39.34,36.93 28.52,36.93 v28.3,37.16 | v56.26,22 53.18,18.91

### Text on the board
tPlace: RFM12B / XTAL | RFM69 / XTAL
tDocu: REG
_tsilk: PiMonitorRF | (c) Prajwal Bhattaram (2016) | v1.0 | http://www.github.com/Pi-Crusts | DTR | VIN | ATMEGA / 328 | FTDI | GND | FLASH | MEM | ANT
_bsilk: PiMonitorRF | v1.0 | (c) Prajwal Bhattaram (2016) | http://www.github.com/Pi-Crusts | DTR | VIN | GND | ANT